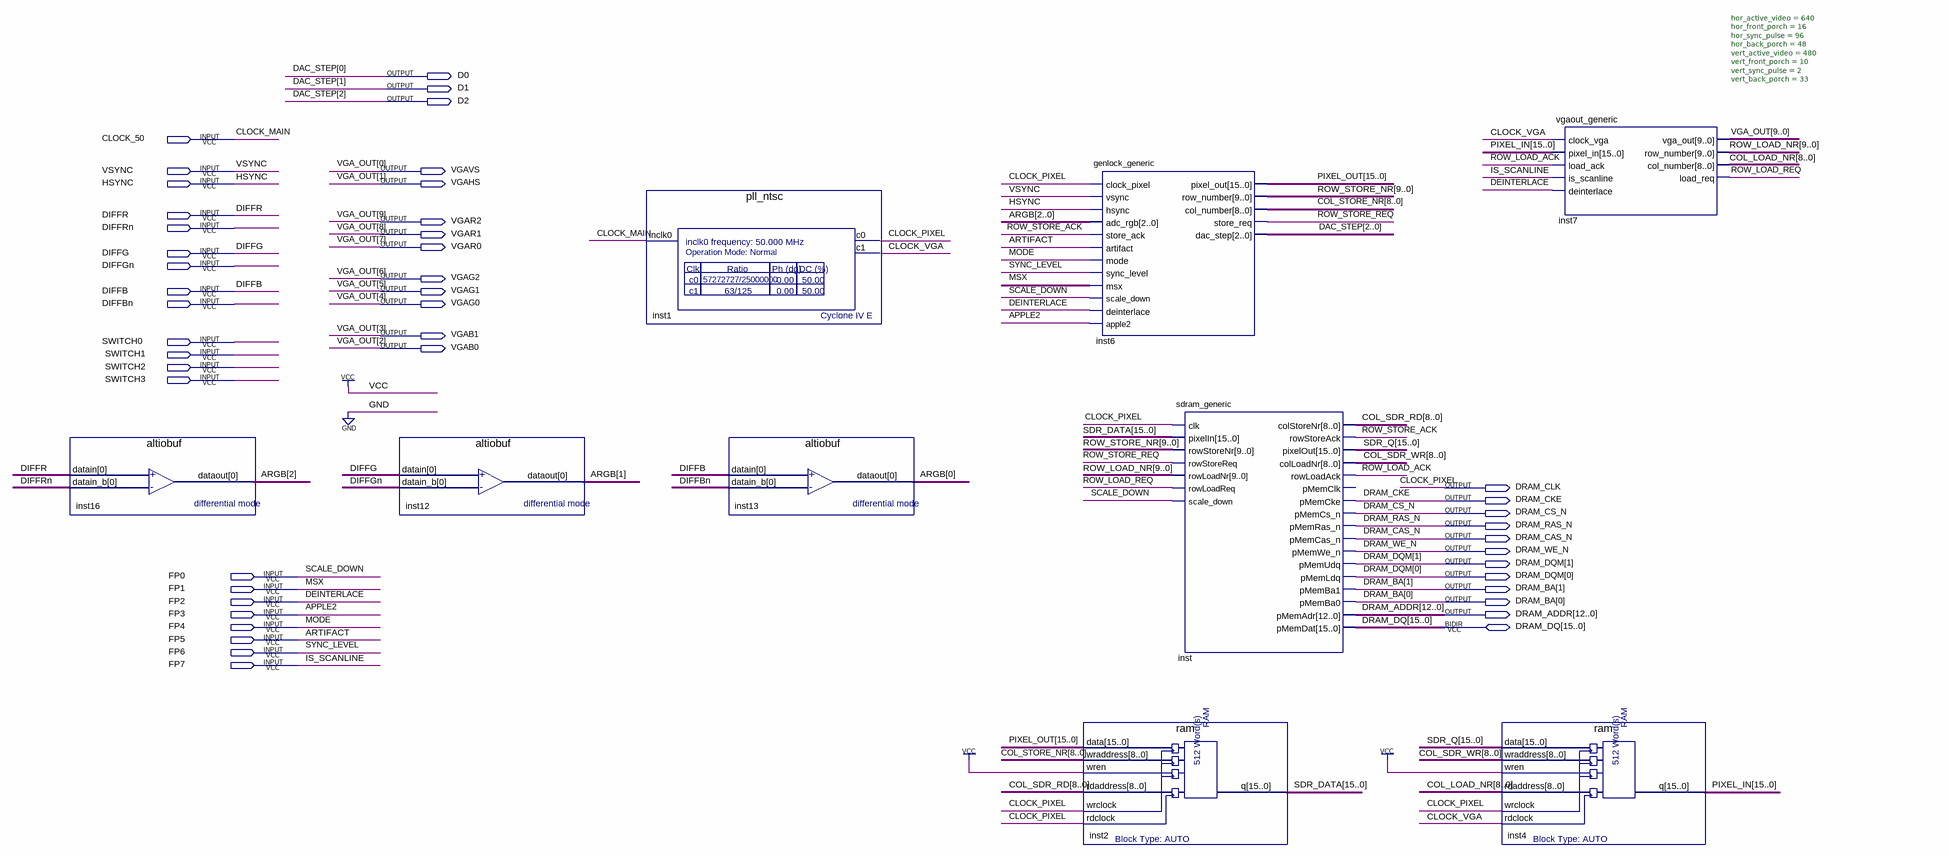
[diagram p0: schematic sheet]
// Quartus schematic top_generic.bdf as structural Verilog: 9 symbols, 46 pins
module top_generic (
  input  CLOCK_50,
  input  VSYNC,
  input  HSYNC,
  input  DIFFR,
  input  DIFFRn,
  input  DIFFG,
  input  DIFFGn,
  input  DIFFB,
  input  DIFFBn,
  input  SWITCH0,
  input  SWITCH1,
  input  SWITCH2,
  input  SWITCH3,
  input  FP0,
  input  FP1,
  input  FP2,
  input  FP3,
  input  FP4,
  input  FP5,
  input  FP6,
  input  FP7,
  inout  [15:0] DRAM_DQ,
  output D0,
  output D1,
  output D2,
  output VGAVS,
  output VGAHS,
  output VGAR2,
  output VGAR1,
  output VGAR0,
  output VGAG2,
  output VGAG1,
  output VGAG0,
  output VGAB1,
  output VGAB0,
  output DRAM_CLK,
  output DRAM_CKE,
  output DRAM_CS_N,
  output DRAM_RAS_N,
  output DRAM_CAS_N,
  output DRAM_WE_N,
  output [1:0] DRAM_DQM,
  output [1:0] DRAM_BA,
  output [12:0] DRAM_ADDR
);

  wire CLOCK_VGA, ROW_LOAD_ACK, ROW_LOAD_REQ, ROW_STORE_ACK, ROW_STORE_REQ;
  wire [2:0] ARGB;
  wire [8:0] COL_LOAD_NR, COL_SDR_RD, COL_SDR_WR, COL_STORE_NR;
  wire [9:0] ROW_LOAD_NR, ROW_STORE_NR;
  wire [15:0] PIXEL_IN, PIXEL_OUT, SDR_DATA, SDR_Q;

  altiobuf inst16 (.datain(DIFFR), .datain_b(DIFFRn), .dataout(ARGB[2]));
  altiobuf inst12 (.datain(DIFFG), .datain_b(DIFFGn), .dataout(ARGB[1]));
  pll_ntsc inst1 (.inclk0(CLOCK_50), .c0(DRAM_CLK), .c1(CLOCK_VGA));
  altiobuf inst13 (.datain(DIFFB), .datain_b(DIFFBn), .dataout(ARGB[0]));
  ram inst2 (
    .data(PIXEL_OUT), .wraddress(COL_STORE_NR), .wren(1'b1), .rdaddress(COL_SDR_RD), .wrclock(DRAM_CLK),
    .rdclock(DRAM_CLK), .q(SDR_DATA));
  genlock_generic inst6 (
    .clock_pixel(DRAM_CLK), .vsync(VSYNC), .hsync(HSYNC), .adc_rgb(ARGB), .store_ack(ROW_STORE_ACK),
    .artifact(FP5), .mode(FP4), .sync_level(FP6), .msx(FP1), .scale_down(FP0), .deinterlace(FP2),
    .apple2(FP3), .pixel_out(PIXEL_OUT), .row_number(ROW_STORE_NR), .col_number(COL_STORE_NR),
    .store_req(ROW_STORE_REQ), .dac_step({D2, D1, D0}));
  sdram_generic inst (
    .clk(DRAM_CLK), .pixelIn(SDR_DATA), .rowStoreNr(ROW_STORE_NR), .rowStoreReq(ROW_STORE_REQ),
    .rowLoadNr(ROW_LOAD_NR), .rowLoadReq(ROW_LOAD_REQ), .scale_down(FP0), .colStoreNr(COL_SDR_RD),
    .rowStoreAck(ROW_STORE_ACK), .pixelOut(SDR_Q), .colLoadNr(COL_SDR_WR), .rowLoadAck(ROW_LOAD_ACK),
    .pMemCke(DRAM_CKE), .pMemCs_n(DRAM_CS_N), .pMemRas_n(DRAM_RAS_N), .pMemCas_n(DRAM_CAS_N),
    .pMemWe_n(DRAM_WE_N), .pMemUdq(DRAM_DQM[1]), .pMemLdq(DRAM_DQM[0]), .pMemBa1(DRAM_BA[1]),
    .pMemBa0(DRAM_BA[0]), .pMemAdr(DRAM_ADDR), .pMemDat(DRAM_DQ));  // open: pMemClk
  ram inst4 (
    .data(SDR_Q), .wraddress(COL_SDR_WR), .wren(1'b1), .rdaddress(COL_LOAD_NR), .wrclock(DRAM_CLK),
    .rdclock(CLOCK_VGA), .q(PIXEL_IN));
  vgaout_generic #(.hor_active_video(640), .hor_front_porch(16), .hor_sync_pulse(96), .hor_back_porch(48), .vert_active_video(480), .vert_front_porch(10), .vert_sync_pulse(2), .vert_back_porch(33)) inst7 (
    .clock_vga(CLOCK_VGA), .pixel_in(PIXEL_IN), .load_ack(ROW_LOAD_ACK), .is_scanline(FP7),
    .deinterlace(FP2), .vga_out({VGAR2, VGAR1, VGAR0, VGAG2, VGAG1, VGAG0, VGAB1, VGAB0, VGAHS, VGAVS}),
    .row_number(ROW_LOAD_NR), .col_number(COL_LOAD_NR), .load_req(ROW_LOAD_REQ));

  // Other names for the same wires on the sheet: APPLE2 = FP3; ARTIFACT = FP5; CLOCK_MAIN = CLOCK_50;
  //   CLOCK_PIXEL = DRAM_CLK; DAC_STEP[2:0] = {D2, D1, D0}; DEINTERLACE = FP2; IS_SCANLINE = FP7; MODE = FP4;
  //   MSX = FP1; SCALE_DOWN = FP0; SYNC_LEVEL = FP6;
  //   VGA_OUT[9:0] = {VGAR2, VGAR1, VGAR0, VGAG2, VGAG1, VGAG0, VGAB1, VGAB0, VGAHS, VGAVS}
endmodule
